# EAGLE design SparkFun_ProtoSnap-LilyTwinkle (EAGLE 6.3)
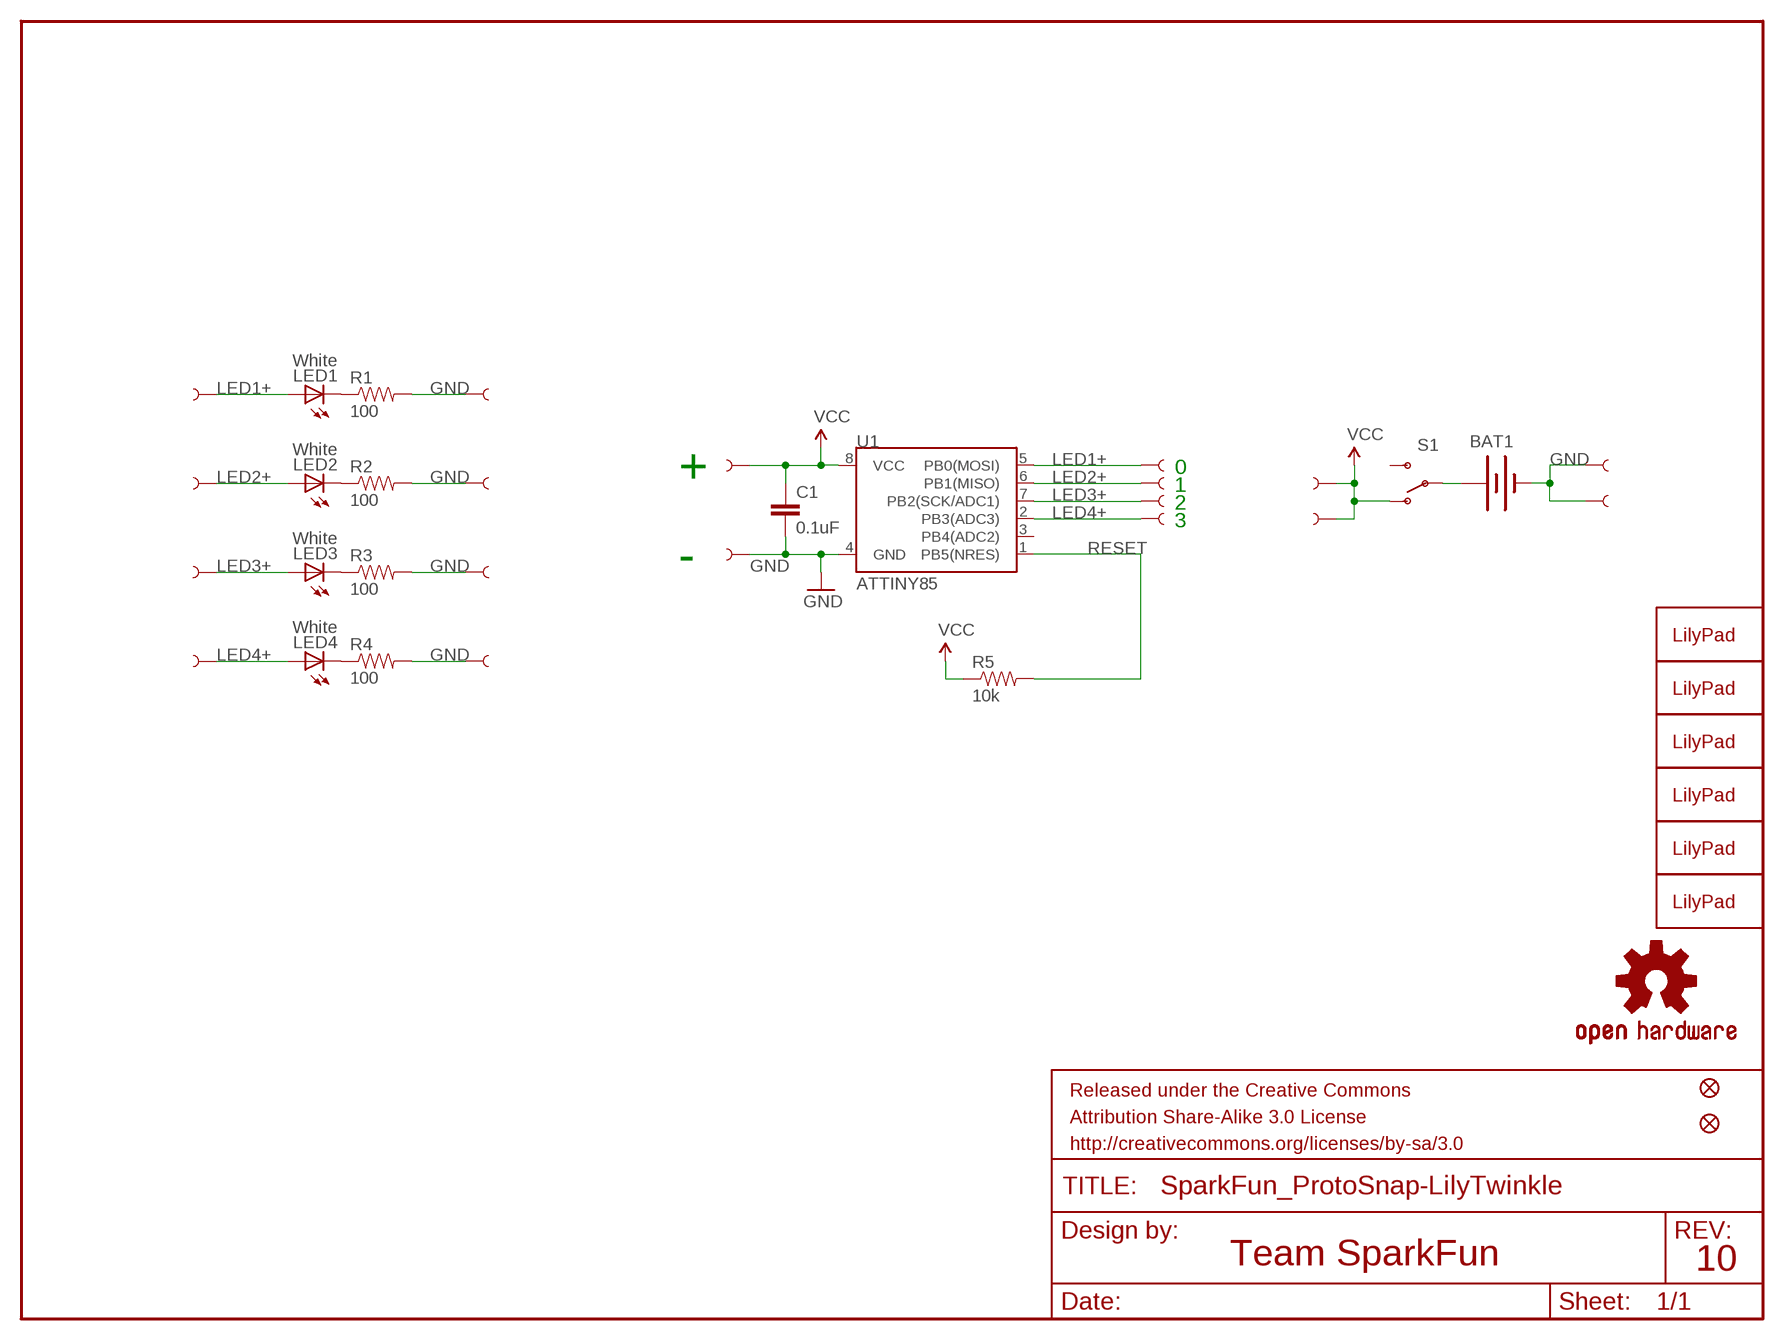
[diagram p0: schematic, sheet 1]

## Parts
1_U$2  SEWTAP6  [PETAL-SMALL-2SIDE]
1_U$3  SEWTAP6  [PETAL-SMALL-2SIDE]
1_U$4  SEWTAP6  [PETAL-SMALL-2SIDE]
1_U$5  SEWTAP6  [PETAL-SMALL-2SIDE]
1_U$6  SEWTAP6  [PETAL-SMALL-2SIDE]
1_U$7  SEWTAP6  [PETAL-SMALL-2SIDE]
3_LED+  SEWTAP6  SEWTAP4  [PETAL-SMALL]
3_LED-  SEWTAP6  SEWTAP2SIDE  [PETAL-SMALL]
4_LED+  SEWTAP6  SEWTAP4  [PETAL-SMALL]
4_LED-  SEWTAP6  SEWTAP2SIDE  [PETAL-SMALL]
5_LED+  SEWTAP6  SEWTAP4  [PETAL-SMALL]
5_LED-  SEWTAP6  SEWTAP2SIDE  [PETAL-SMALL]
6_LED+  SEWTAP6  SEWTAP4  [PETAL-SMALL]
6_LED-  SEWTAP6  SEWTAP2SIDE  [PETAL-SMALL]
B1+  SEWTAP6  [PETAL-SMALL-2SIDE]
B1-  SEWTAP6  [PETAL-SMALL-2SIDE]
B2+  SEWTAP6  [PETAL-SMALL-2SIDE]
B2-  SEWTAP6  [PETAL-SMALL-2SIDE]
BAT1  BATTERY20MM_4LEGS  [BATTCON_20MM_4LEGS]
BATT_LOGO  LOGO-LPLP  [LOGO-LILYPAD]
BATT_OHS  OSHW-LOGOS  [OSHW-LOGO-S]
C1  0.1uF  .1UF-CER  [0402-CAP]
FRAME1  FRAME-LETTER  [CREATIVE_COMMONS]
JP1  FIDUCIALUFIDUCIAL  [MICRO-FIDUCIAL]
JP2  FIDUCIALUFIDUCIAL  [MICRO-FIDUCIAL]
LED1  White  LED-WHITE  [LED-1206]
LED1_LOGO  LOGO-LPL  [LOGO-L]
LED2  White  LED-WHITE  [LED-1206]
LED2_LOGO  LOGO-LPL  [LOGO-L]
LED3  White  LED-WHITE  [LED-1206]
LED3_LOGO  LOGO-LPL  [LOGO-L]
LED4  White  LED-WHITE  [LED-1206]
LED4_LOGO  LOGO-LPL  [LOGO-L]
R1  100  RESISTOR0603-RES  [0603-RES]
R2  100  RESISTOR0603-RES  [0603-RES]
R3  100  RESISTOR0603-RES  [0603-RES]
R4  100  RESISTOR0603-RES  [0603-RES]
R5  10k  10K-1%RES-00824  [0402-RES]
S1  SWITCH-SPDTSMD  [AYZ0202]
TINY_LOGO  LOGO-LPL  [LOGO-L]
U1  ATTINY85  ATTINY45TINY85-20-SMT  [SO08-EIAJ]

## Nets
2_N$3: BAT1.1(+) S1.2(P)
3_N$1: LED3.C R3.1
4_N$1: LED4.C R4.1
5_N$1: LED2.C R2.1
6_N$1: LED1.C R1.1
GND: 1_U$2.1 3_LED-.1 4_LED-.1 5_LED-.1 6_LED-.1 B1-.1 B2-.1 BAT1.2(-) C1.2 R1.2 R2.2 R3.2 R4.2 U1.4(GND)
LED1+: 1_U$7.1 6_LED+.1 LED1.A U1.5(PB0(MOSI))
LED2+: 1_U$3.1 5_LED+.1 LED2.A U1.6(PB1(MISO))
LED3+: 1_U$4.1 3_LED+.1 LED3.A U1.7(PB2(SCK/ADC1))
LED4+: 1_U$6.1 4_LED+.1 LED4.A U1.2(PB3(ADC3))
RESET: R5.2 U1.1(PB5(NRES))
V+: 1_U$5.1 B1+.1 B2+.1 C1.1 R5.1 S1.1(O) U1.8(VCC) ; supply symbol labelled VCC
Unconnected: S1.3(S) U1.3(PB4(ADC2))

## Notes on the sheet
- 0
- +
- 1
- 2
- 3
- -
- Team SparkFun | 10

## Library data of the parts
1_U$2-1_U$7 = 1_LilyPad-Wearables:SEWTAP
3_LED+ 3_LED- = 3_LilyPad-Wearables:SEWTAP
4_LED+ 4_LED- = 4_LilyPad-Wearables:SEWTAP
5_LED+ 5_LED- = 5_LilyPad-Wearables:SEWTAP
6_LED+ 6_LED- = 6_LilyPad-Wearables:SEWTAP
B1+ B1- B2+ B2- = 2_LilyPad-Wearables:SEWTAP
BAT1 = SparkFun-Electromechanical:BATTERY: Battery Holders Various common sizes : AA, AAA, 20mm coin cell and 12mm coin cell. 20MM_4LEGS, BATT-10373; PROD_ID: BATT-10373; VALUE: 20mm coincell
BATT_LOGO LED1_LOGO LED2_LOGO LED3_LOGO LED4_LOGO TINY_LOGO = LilyPad-Wearables:LOGO-LP
BATT_OHS = 2_SparkFun-Aesthetics:OSHW-LOGO: Open Source Hardware Logo This logo indicates the piece of hardware it is found on incorporates a OSHW license and/or adheres to the definition of open source hardware found here: http://freedomdefined.org/OSHW
C1 = SparkFun-Capacitors:.1UF-CER: .1uF ceramic SMT CAP-00810- 25V +80%/-20% (0603) CAP-08390- 100V 10% (0603) CAP-08604- 25V 5% (0603); PROD_ID: CAP-00810
FRAME1 = SparkFun-Aesthetics:FRAME-LETTER: Schematic Frame Standard 8.5x11 US Letter frame
JP1 JP2 = SparkFun:FIDUCIAL: Fiducial Alignment Points Various fiducial points for machine vision alignment.
LED1-LED4 = SparkFun-LED:LED-WHITE: White SMD LEDs LilyPad 1206- DIO-09955; PROD_ID: DIO-09955; VALUE: WHITE
R1 = 6_SparkFun:RESISTOR: Resistor Basic schematic elements and footprints for 0603, 1206, and PTH resistors.; PROD_ID: RES-07863
R2 = 5_SparkFun:RESISTOR: Resistor Basic schematic elements and footprints for 0603, 1206, and PTH resistors.; PROD_ID: RES-07863
R3 = 3_SparkFun:RESISTOR: Resistor Basic schematic elements and footprints for 0603, 1206, and PTH resistors.; PROD_ID: RES-07863
R4 = 4_SparkFun:RESISTOR: Resistor Basic schematic elements and footprints for 0603, 1206, and PTH resistors.; PROD_ID: RES-07863
R5 = SparkFun-Resistors:10K-1%: 10k-ohm SMT 1/10W - 1% (0603) RES-00824; PROD_ID: RES-00824
S1 = SparkFun-Electromechanical:SWITCH-SPDT: SPDT Switch Simple slide switch, Spark Fun Electronics SKU : COM-00102 DPDT SMT slide switch, AYZ0202, SWCH-08179; PROD_ID: SWCH-08179
U1 = SparkFun-DigitalIC:ATTINY45: Atmel 8-pin 2/4/8kB flash uC; PROD_ID: IC-09092; VALUE: Tiny85-20-SMT

## Board
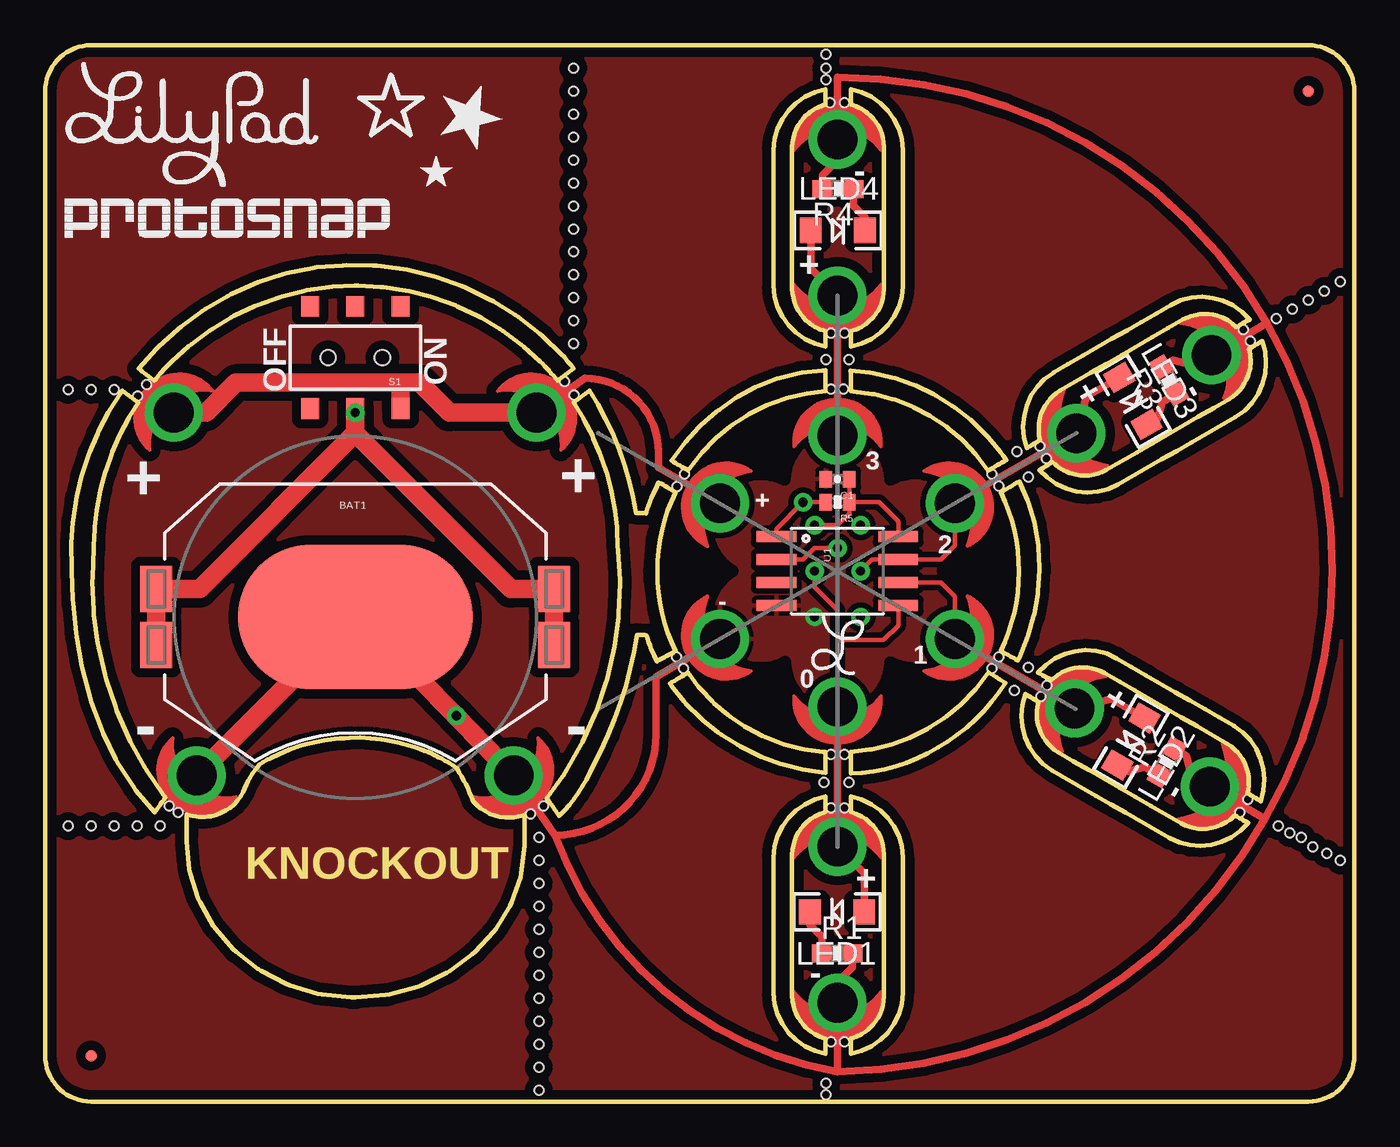
[diagram p1: board, top side]
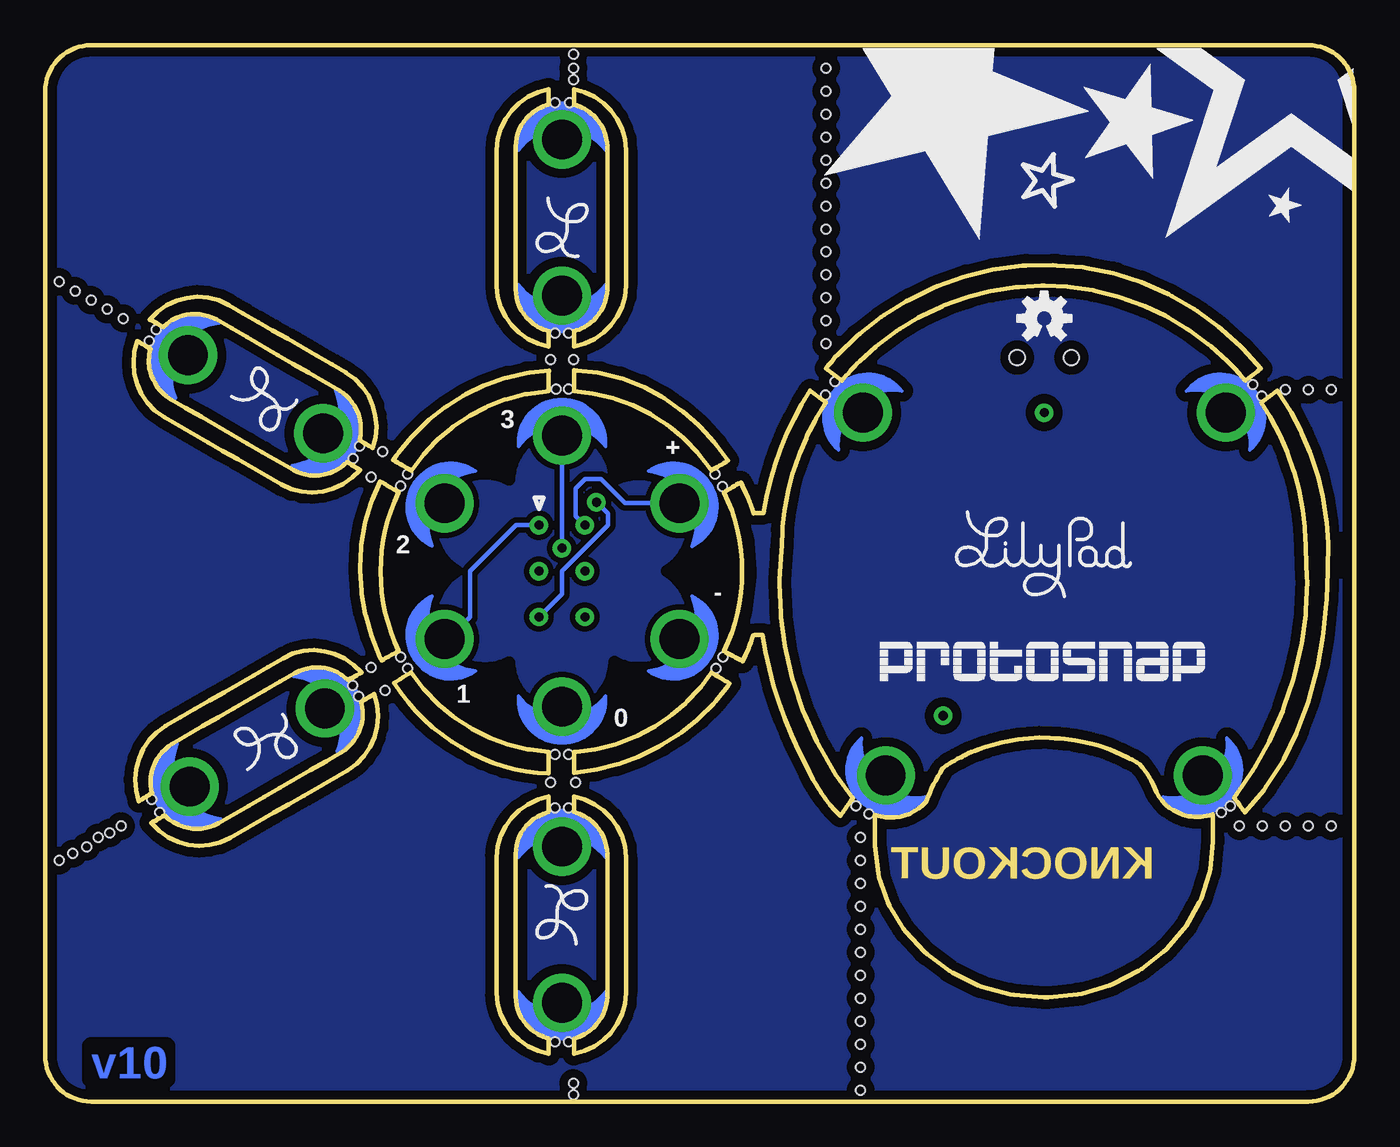
[diagram p2: board, bottom side, seen from below]

Size 72.39 x 58.42 mm. Coordinates in mm from the lower left corner, seen from the top.
Outline: 40.28,45.13 40.28,52.6 40.33,53.22 40.5,53.79 40.76,54.33 41.1,54.8 41.52,55.22 42.01,55.56 42.56,55.82 43.16,55.98 43.16,55.77 43.15,55.66 43.15,55.13 43,55.09 42.72,54.97 42.58,54.9 42.45,54.82 42.32,54.73 42.2,54.64 42.08,54.54 41.91,54.36 41.77,54.17 41.64,53.96 41.53,53.75 41.44,53.52 41.37,53.28 41.33,53.05 41.31,52.8 41.31,44.93 41.33,44.69 41.37,44.45 41.44,44.21 41.53,43.99 41.64,43.77 41.77,43.56 41.91,43.37 42.08,43.2 42.2,43.09 42.32,43 42.45,42.91 42.58,42.83 42.72,42.76 42.86,42.7 43,42.65 43.15,42.6 43.15,42.07 43.16,41.96 43.16,41.75 42.56,41.92 42.01,42.17 41.52,42.51 41.1,42.93 40.76,43.41 40.5,43.94 40.33,44.52 40.28,45.13
Outline: 40.28,45.13 40.28,45.1
Outline: 55.75,40.3 56.56,40.77 57.38,41.24 59,42.18 59.81,42.64 60.62,43.11 61.44,43.58 62.25,44.05 62.81,44.31 63.39,44.46 63.98,44.5 64.56,44.44 65.13,44.28 65.67,44.03 66.17,43.68 66.61,43.25 66.43,43.15 66.34,43.09 66.24,43.04 66.15,42.99 66.06,42.93 65.88,42.83 65.64,43.03 65.52,43.12 65.39,43.21 65.11,43.35 64.97,43.41 64.82,43.45 64.59,43.51 64.35,43.54 64.1,43.55 63.86,43.54 63.62,43.5 63.39,43.44 63.16,43.36 62.94,43.26 62.09,42.76 61.23,42.27 59.53,41.29 58.68,40.79 57.82,40.3 56.12,39.32 55.92,39.18 55.73,39.02 55.56,38.85 55.41,38.66 55.28,38.46 55.16,38.24 55.07,38.02 55,37.79 54.97,37.63 54.95,37.48 54.94,37.33 54.94,37.02 54.96,36.87 55.02,36.57 54.93,36.52 54.84,36.46 54.75,36.41 54.65,36.35 54.56,36.3 54.47,36.24 54.29,36.14 54.13,36.73 54.08,37.34 54.14,37.93 54.28,38.5 54.52,39.04 54.86,39.53 55.27,39.96 55.78,40.31
Outline: 65.73,20.77 66.23,20.42 66.64,19.99 66.97,19.51 67.21,18.97 67.36,18.4 67.42,17.81 67.37,17.21 67.22,16.61 67.13,16.67 67.04,16.72 66.95,16.78 66.85,16.83 66.76,16.89 66.67,16.94 66.58,17 66.49,17.05 66.52,17.2 66.56,17.5 66.56,17.8 66.55,17.95 66.53,18.1 66.5,18.24 66.43,18.48 66.34,18.7 66.22,18.92 66.09,19.12 65.94,19.31 65.77,19.48 65.58,19.64 65.38,19.78 63.68,20.76 62.82,21.25 61.97,21.75 60.27,22.73 59.41,23.22 58.56,23.71 58.34,23.82 58.11,23.9 57.88,23.96 57.64,24 57.4,24.01 57.15,24 56.91,23.97 56.68,23.91 56.53,23.87 56.39,23.81 56.26,23.75 56,23.59 55.76,23.41 55.65,23.31 55.55,23.36 55.37,23.46 55.28,23.52 55.18,23.57 55,23.67 54.9,23.73 55.34,24.15 55.84,24.49 56.38,24.74 56.95,24.9 57.53,24.96 58.12,24.91 58.7,24.77 59.25,24.51 60.06,24.04 60.88,23.57 62.5,22.63 63.31,22.17 64.12,21.7 64.94,21.23 65.75,20.76
Outline: 40.28,6.01 40.28,13.49 40.33,14.1 40.5,14.68 40.76,15.21 41.1,15.69 41.52,16.1 42.01,16.44 42.56,16.7 43.16,16.87 43.16,16.65 43.15,16.55 43.15,16.02 43,15.97 42.86,15.92 42.58,15.78 42.32,15.62 42.08,15.42 41.91,15.24 41.77,15.05 41.64,14.85 41.53,14.63 41.44,14.4 41.37,14.17 41.33,13.93 41.31,13.69 41.31,5.81 41.33,5.57 41.37,5.33 41.44,5.1 41.53,4.87 41.64,4.65 41.77,4.45 41.91,4.26 42.08,4.08 42.32,3.88 42.58,3.72 42.86,3.58 43,3.53 43.15,3.48 43.15,2.95 43.16,2.85 43.16,2.63 42.56,2.8 42.01,3.06 41.52,3.4 41.1,3.81 40.76,4.29 40.5,4.82 40.33,5.4 40.28,6.01
Outline: 40.28,6.01 40.28,5.99
Outline: 47.43,6.01 47.43,13.49 47.37,14.1 47.21,14.68 46.95,15.21 46.6,15.69 46.18,16.1 45.69,16.44 45.14,16.7 44.55,16.87 44.55,16.12 44.56,16.01 44.7,15.97 44.85,15.92 45.13,15.78 45.39,15.62 45.51,15.52 45.62,15.42 45.79,15.24 45.94,15.05 46.07,14.85 46.18,14.63 46.27,14.4 46.33,14.17 46.37,13.93 46.39,13.69 46.39,5.81 46.37,5.57 46.33,5.33 46.27,5.1 46.18,4.87 46.07,4.65 45.94,4.45 45.79,4.26 45.62,4.08 45.51,3.98 45.39,3.88 45.13,3.72 44.85,3.58 44.7,3.53 44.56,3.49 44.55,3.38 44.55,2.63 45.14,2.8 45.69,3.06 46.18,3.4 46.6,3.81 46.95,4.29 47.21,4.82 47.37,5.4 47.43,6.01
Outline: 47.43,6.01 47.43,5.99
Outline: 35.56,34.9 35.64,35.01 36.24,35.79 36.33,35.9 37.01,36.6 37.11,36.69 37.86,37.32 37.98,37.4 38.8,37.94 38.92,38.01 39.8,38.45 39.93,38.51 40.87,38.85 41,38.9 41.98,39.13 42.13,39.16 43.15,39.28 43.15,40.44 42.99,40.43 41.86,40.31 41.71,40.29 40.62,40.02 40.47,39.97 39.43,39.57 39.28,39.5 38.3,38.98 38.17,38.89 37.25,38.25 37.12,38.15 36.28,37.41 36.17,37.3 35.41,36.47 35.3,36.34 34.64,35.44 34.75,35.37 34.87,35.3 34.98,35.23 35.1,35.17 35.21,35.1 35.33,35.03 35.44,34.97 35.56,34.9
Outline: 29.22,40.54 29.16,40.62 29.1,40.69 29.03,40.77 28.97,40.85 28.9,40.93 28.84,41 28.77,41.08 28.71,41.16 28.57,41.31 27.51,42.33 27.35,42.46 26.19,43.37 26.01,43.49 24.76,44.26 24.58,44.36 23.25,45.01 23.05,45.09 21.66,45.59 21.46,45.65 20.03,46 19.82,46.03 18.36,46.22 18.15,46.23 16.68,46.25 16.46,46.24 15,46.13 14.79,46.1 13.36,45.82 13.16,45.77 11.79,45.32 11.6,45.24 10.28,44.65 10.1,44.55 8.86,43.82 8.68,43.71 7.52,42.85 7.36,42.72 6.29,41.74 6.14,41.6 5.17,40.52 5.28,40.44 5.38,40.36 5.6,40.2 5.71,40.11 5.81,40.03 6.03,39.87 6.13,39.99 6.24,40.12 6.34,40.24 6.67,40.6 7.03,40.96 7.95,41.79 8.09,41.9 9.09,42.64 9.24,42.73 10.31,43.37 10.46,43.45 11.59,43.98 11.75,44.05 12.92,44.47 13.09,44.52 14.3,44.82 14.47,44.86 15.7,45.04 15.88,45.06 17.12,45.12 17.3,45.12 18.54,45.05 18.71,45.04 19.94,44.85 20.12,44.81 21.32,44.5 21.49,44.45 22.66,44.03 22.82,43.96 23.95,43.43 24.1,43.34 25.17,42.71 25.32,42.61 26.32,41.87 26.45,41.76 27.37,40.92 27.5,40.8 27.63,40.67 27.87,40.41 27.99,40.27 28.11,40.14 28.22,40 28.34,39.86 28.45,39.95 28.56,40.03 28.67,40.12 28.78,40.2 28.89,40.29 29.11,40.45 29.22,40.54
Outline: 33.25,25.78 33.31,25.6 33.37,25.41 33.44,25.23 33.51,25.04 33.58,24.86 33.66,24.69 33.74,24.51 33.83,24.33 33.96,24.41 34.22,24.55 34.35,24.63 34.74,24.84 34.87,24.92 34.64,25.42 34.43,25.94 34.26,26.47 34.12,27.02 34,27.58 33.92,28.14 33.87,28.72 33.85,29.31 33.87,29.89 33.92,30.47 34,31.04 34.11,31.59 34.26,32.14 34.43,32.67 34.63,33.19 34.86,33.69 34.75,33.76 34.51,33.9 34.4,33.97 34.28,34.04 34.17,34.11 34.05,34.18 33.93,34.24 33.83,34.04 33.63,33.62 33.54,33.4 33.45,33.19 33.29,32.75 33.22,32.53 33.15,32.54 32.74,32.54 32.67,32.55 32.5,33.44 32.29,34.33 32.03,35.21 31.73,36.07 31.39,36.91 31,37.73 30.57,38.54 30.1,39.32 29.99,39.24 29.88,39.15 29.55,38.91 29.45,38.82 29.23,38.66 29.3,38.55 29.78,37.76 29.84,37.64 30.26,36.82 30.31,36.7 30.67,35.85 30.72,35.73 31.02,34.86 31.06,34.73 31.29,33.84 31.32,33.71 31.49,32.81 31.51,32.68 31.62,31.76 31.63,31.63 31.66,30.71 31.69,30.48 31.78,28.85 31.79,28.62 31.72,27 31.7,26.77 31.48,25.16 31.44,24.93 31.07,23.35 31,23.13 30.48,21.59 30.39,21.37 29.73,19.89 29.62,19.69 28.81,18.28 28.69,18.08 27.74,16.76 27.83,16.64 27.91,16.52 28,16.4 28.08,16.28 28.17,16.16 28.25,16.04 28.43,15.8 28.72,16.09 29,16.41 29.26,16.74 29.5,17.09 29.73,17.45 29.94,17.82 30.13,18.19 30.3,18.56 30.74,19.41 31.14,20.27 31.5,21.16 31.82,22.06 32.11,22.98 32.35,23.91 32.56,24.86 32.72,25.81 32.79,25.81 32.85,25.8 32.98,25.8 33.05,25.79 33.18,25.79 33.25,25.78
Outline: 34.55,23.12 34.64,22.99 35.33,22.12 35.44,22 36.23,21.21 36.35,21.11 37.22,20.41 37.36,20.31 38.3,19.71 38.44,19.64 39.45,19.14 39.6,19.07 40.65,18.68 40.81,18.64 41.89,18.36 42.05,18.33 43.16,18.18 43.16,18.32 43.15,18.46 43.15,19.33 43,19.34 41.98,19.48 41.84,19.51 40.86,19.76 40.73,19.81 39.8,20.16 39.67,20.22 38.79,20.68 38.67,20.75 37.86,21.3 37.75,21.39 37,22.02 36.9,22.12 36.23,22.83 36.14,22.94 35.56,23.72 35.43,23.65 35.3,23.57 35.18,23.5 35.05,23.42 34.92,23.35 34.8,23.27 34.67,23.2 34.55,23.12
Outline: 53.15,35.48 53.12,35.51 53.1,35.55 53.07,35.59 53.04,35.62 53.01,35.66 52.99,35.7 52.96,35.73 52.84,35.89 52.15,36.73 52.05,36.84 51.27,37.6 51.16,37.7 50.3,38.37 50.17,38.46 49.25,39.03 49.12,39.11 48.14,39.58 48,39.64 46.98,40 46.83,40.04 45.77,40.29 45.62,40.31 44.54,40.43 44.55,40.29 44.55,39.71 44.56,39.57 44.56,39.28 44.71,39.27 45.72,39.13 45.87,39.11 46.84,38.85 46.98,38.81 47.91,38.45 48.03,38.39 48.91,37.94 49.84,37.32 49.95,37.23 50.7,36.6 50.8,36.5 51.47,35.79 51.56,35.68 52.14,34.9 52.4,35.04 52.52,35.11 52.65,35.19 52.77,35.26 52.9,35.33 53.02,35.4 53.15,35.48
Outline: 44.55,18.14 45.17,18.18 45.8,18.26 46.41,18.37 47.03,18.53 47.63,18.73 48.22,18.97 48.79,19.25 49.36,19.57 49.92,19.91 50.46,20.29 50.97,20.69 51.45,21.13 51.91,21.6 52.34,22.09 52.74,22.61 53.1,23.15 52.74,23.36 52.63,23.44 52.15,23.72 52.07,23.61 51.47,22.83 51.38,22.73 50.7,22.02 50.6,21.93 49.85,21.3 49.73,21.22 48.91,20.68 48.79,20.61 47.91,20.17 47.78,20.11 46.84,19.76 46.71,19.72 45.72,19.48 45.58,19.46 44.56,19.33 44.56,18.88 44.55,18.73 44.55,18.14
Outline: 53.8,24.4 53.87,24.54 54.35,25.74 54.66,26.82 54.7,26.97 54.89,28.08 54.91,28.24 54.99,29.36 54.99,29.52 54.93,30.63 54.92,30.79 54.74,31.89 54.7,32.04 54.38,33.12 54.33,33.27 53.87,34.29 53.74,34.22 53.61,34.14 53.48,34.07 53.36,33.99 53.1,33.85 52.97,33.77 52.84,33.7 53.07,33.19 53.27,32.67 53.45,32.14 53.59,31.6 53.7,31.04 53.78,30.47 53.83,29.89 53.85,29.31 53.83,28.72 53.78,28.14 53.7,27.58 53.59,27.02 53.44,26.48 53.27,25.94 53.07,25.42 52.84,24.92 52.96,24.86 53.08,24.79 53.2,24.73 53.44,24.59 53.56,24.53 53.68,24.46 53.8,24.4
Outline: 6.65,16.82 6.51,17 5.61,18.32 5.49,18.52 4.71,19.92 4.61,20.12 3.97,21.59 3.89,21.81 3.38,23.33 3.32,23.55 2.96,25.11 2.92,25.33 2.7,26.92 2.68,27.15 2.61,28.75 2.62,28.98 2.7,30.58 2.7,30.71 2.74,31.65 2.75,31.78 2.86,32.71 2.88,32.84 3.05,33.76 3.08,33.89 3.33,34.8 3.37,34.92 3.67,35.81 3.72,35.93 4.09,36.79 4.15,36.92 4.58,37.75 4.65,37.86 5.14,38.66 5.03,38.74 4.92,38.83 4.7,38.99 4.59,39.08 4.37,39.24 4.26,39.33 4.17,39.19 3.57,38.24 3.49,38.1 2.97,37.1 2.9,36.95 2.46,35.92 2.4,35.77 2.05,34.7 2,34.54 1.74,33.45 1.71,33.29 1.54,32.17 1.52,32.01 1.45,30.88 1.45,30.72 1.48,29.58 1.48,29.35 1.53,27.76 1.55,27.53 1.71,25.92 1.74,25.69 2.03,24.1 2.08,23.87 2.49,22.31 2.56,22.09 3.12,20.58 3.21,20.37 3.91,18.93 4.02,18.73 4.89,17.39 5.02,17.21 6.06,15.98 6.13,16.09 6.21,16.19 6.28,16.3 6.35,16.4 6.43,16.51 6.5,16.61 6.58,16.72 6.65,16.82
Outline: 7.84,15.88 8.01,15.83 8.17,15.79 8.34,15.77 8.5,15.75 8.67,15.74 8.84,15.74 9.01,15.76 9.17,15.78 9.45,15.85 9.72,15.96 9.98,16.09 10.22,16.25 10.44,16.43 10.64,16.64 10.81,16.87 10.96,17.12 11.04,17.32 11.13,17.52 11.24,17.72 11.34,17.92 11.46,18.11 11.72,18.47 11.86,18.64 12.04,18.76 12.31,18.91 12.41,18.96 12.5,19 12.9,19.2 13.21,19.33 13.53,19.46 14.17,19.68 14.5,19.77 15.16,19.91 15.44,19.96 16,20.04 16.28,20.07 16.56,20.09 16.85,20.11 17.41,20.13 18.01,20.09 18.31,20.06 18.61,20.02 18.9,19.97 19.2,19.92 19.49,19.86 19.79,19.78 19.99,19.73 20.39,19.61 20.79,19.47 20.98,19.4 21.18,19.32 21.37,19.24 21.44,19.2 21.51,19.17 21.57,19.14 21.64,19.1 21.71,19.07 21.77,19.04 21.84,19 21.91,18.97 22.13,18.85 22.25,18.79 22.35,18.72 22.57,18.58 22.77,18.42 22.9,18.21 23.03,17.99 23.15,17.77 23.27,17.54 23.38,17.31 23.48,17.08 23.57,16.85 23.66,16.61 23.86,16.4 24.09,16.21 24.33,16.06 24.59,15.92 24.86,15.82 25.14,15.75 25.43,15.71 25.72,15.7 25.82,15.71 25.93,15.72 26.03,15.73 26.33,15.79 26.43,15.82 26.52,15.86 26.52,14.13 26.33,12.62 26.28,12.41 25.79,11.01 25.7,10.81 24.93,9.55 24.8,9.38 23.78,8.27 23.62,8.13 22.4,7.22 22.21,7.11 20.81,6.43 20.6,6.35 19.06,5.93 18.83,5.89 17.17,5.75 16.93,5.76 15.29,5.93 15.06,5.97 13.53,6.43 13.32,6.51 11.94,7.22 11.76,7.34 10.56,8.27 10.4,8.42 9.42,9.55 9.29,9.72 8.56,11.01 8.47,11.2 8.01,12.62 7.97,12.83 7.82,14.36 7.82,14.55 7.83,14.74 7.83,15.12 7.84,15.31 7.84,15.88
Outline: 47.43,45.1 47.37,44.52 47.21,43.94 46.95,43.41 46.6,42.93 46.18,42.51 45.69,42.17 45.14,41.92 44.55,41.75 44.55,42.49 44.56,42.6 44.7,42.65 44.85,42.7 44.99,42.76 45.13,42.83 45.26,42.91 45.39,43 45.51,43.09 45.79,43.37 45.94,43.56 46.07,43.77 46.18,43.99 46.27,44.21 46.33,44.45 46.37,44.69 46.39,44.93 46.39,52.8 46.37,53.05 46.33,53.28 46.27,53.52 46.18,53.75 46.07,53.96 45.94,54.17 45.79,54.36 45.62,54.54 45.51,54.64 45.39,54.73 45.26,54.82 45.13,54.9 44.99,54.97 44.85,55.03 44.7,55.09 44.56,55.13 44.55,55.24 44.55,55.98 45.14,55.82 45.69,55.56 46.18,55.22 46.6,54.8 46.95,54.33 47.21,53.79 47.37,53.22 47.43,52.6 47.43,45.1
Outline: 65.82,37.86 63.39,36.45 62.57,35.98 61.76,35.52 59.33,34.11 58.79,33.87 58.21,33.72 57.62,33.68 57.03,33.74 56.46,33.9 55.92,34.15 55.42,34.5 54.98,34.93 55.07,34.98 55.16,35.04 55.26,35.09 55.35,35.14 55.44,35.2 55.62,35.3 55.71,35.36 55.83,35.25 55.95,35.15 56.07,35.06 56.2,34.97 56.34,34.89 56.48,34.83 56.63,34.77 56.77,34.72 57.01,34.66 57.25,34.63 57.49,34.62 57.74,34.63 57.98,34.67 58.21,34.73 58.44,34.81 58.66,34.92 60.36,35.9 61.22,36.4 63.77,37.87 64.63,38.36 65.48,38.86 65.68,38.99 65.86,39.15 66.03,39.32 66.19,39.51 66.32,39.72 66.43,39.93 66.53,40.16 66.59,40.39 66.63,40.54 66.65,40.7 66.66,40.85 66.66,41.01 66.65,41.16 66.64,41.32 66.61,41.47 66.57,41.62 66.66,41.68 66.76,41.73 66.85,41.79 67.03,41.89 67.12,41.95 67.21,42 67.31,42.06 67.46,41.46 67.51,40.85 67.46,40.25 67.32,39.68 67.08,39.14 66.75,38.65 66.33,38.22 65.82,37.86
Outline: 55.68,18.32 58.11,16.91 58.93,16.44 59.74,15.98 62.17,14.57 62.71,14.32 63.3,14.18 63.89,14.14 64.48,14.2 65.05,14.36 65.6,14.62 66.1,14.97 66.54,15.41 66.44,15.46 66.26,15.56 66.17,15.62 66.07,15.67 65.89,15.77 65.8,15.83 65.56,15.61 65.3,15.43 65.02,15.29 64.88,15.23 64.73,15.18 64.49,15.12 64.25,15.09 64.01,15.08 63.76,15.09 63.52,15.13 63.29,15.19 63.06,15.27 62.84,15.38 61.14,16.36 60.28,16.85 59.43,17.35 57.73,18.33 56.87,18.82 56.02,19.31 55.82,19.45 55.64,19.61 55.47,19.78 55.31,19.97 55.18,20.18 55.07,20.39 54.98,20.62 54.91,20.85 54.87,21 54.85,21.16 54.84,21.32 54.84,21.48 54.85,21.63 54.89,21.95 54.93,22.1 54.84,22.15 54.75,22.21 54.66,22.26 54.57,22.32 54.48,22.37 54.38,22.42 54.29,22.48 54.2,22.53 54.04,21.93 53.99,21.32 54.03,20.73 54.18,20.15 54.42,19.6 54.75,19.11 55.17,18.68 55.68,18.32
Outline: 69.85,0 2.54,0 arc-90 0,2.54 0,55.88 arc-90 2.54,58.42 69.85,58.42 arc-90 72.39,55.88 72.39,2.54 arc-90 69.85,0
Copper layers (1*16): Top 0.035mm / dielectric 1.5mm / Bottom 0.035mm
Design rules "default": minimum track width 8mil, minimum drill 20mil, track to track 8mil, track to pad 8mil, pad to pad 8mil, via to via 8mil, smd to smd 8mil, copper to edge 8mil, drill to drill 8mil, minimum pad ring 12mil, minimum via ring 10mil, stop-mask expansion 4mil, vias tented up to drill 20mil, thermal gap 10mil
Holes 0.51 mm at 6.85,16.35 7.35,16 5.6,39.65 5.12,39.02 28.73,39.8 29.25,39.08 26.85,15.9 27.55,16.35 43.4,55.25 44.2,55.25 43.45,42.5 44.2,42.5 43.45,39.4 44.15,39.4 35.35,34.7 34.95,34 34.9,24.6 35.3,23.95 43.45,19.2 44.2,19.2 52.35,23.95 52.75,24.6 55.4,23 55.05,22.4 66.5,16.7 66.05,16 43.45,16.25 44.2,16.25 43.45,3.3 44.2,3.3 52.35,34.7 52.75,34.05 55,36.25 55.35,35.55 66.25,42.7 66.65,42.05 6.35,15.24 5.08,15.24 3.81,15.24 2.54,15.24 1.27,15.24 3.81,39.37 2.54,39.37 1.27,39.37 27.3,14.61 27.3,13.34 27.3,12.06 27.3,10.79 27.3,9.53 27.3,8.26 27.3,6.99 27.3,5.71 27.3,4.45 27.3,3.17 27.3,1.91 27.3,0.64 29.21,41.91 29.21,43.18 29.21,44.45 29.21,45.72 29.21,46.99 29.21,48.26 29.21,49.53 29.21,50.8 29.21,52.07 29.21,53.34 29.21,54.61 29.21,55.88 29.21,57.15 43.18,57.91 43.18,57.15 43.18,56.52 43.18,0.38 43.18,1.02 44.45,17.65 43.05,17.65 53.59,22.73 54.36,24 54.36,34.54 53.72,35.94 43.18,41.02 44.45,41.02 68.07,43.31 68.96,43.81 69.85,44.32 70.74,44.83 71.63,45.34 68.2,15.24 68.83,14.86 69.47,14.61 70.1,14.1 70.87,13.72 71.63,13.34
tRestrict: area 33.6,29.3 to 54,39.6; area 33.6,19.1 to 54,29.4
bRestrict: area 33.6,29.3 to 54,39.6; area 33.6,19.1 to 54,29.4

### Footprints (pad centres in the part's own frame; a part is rotated, then mirrored left to right if it is on the bottom)
PETAL-SMALL-2SIDE = drill 2.2: 1 0,0
PETAL-SMALL = drill 2.2: 1 0,0
BATTCON_20MM_4LEGS = smd 1.778 x 2.54: 1 -11,1.55; 3 11,1.55; P$1 -11,-1.55; P$2 11,-1.55 | smd 13 x 8: 2 0,0
0402-CAP = smd 0.7 x 0.9: 1 -0.65,0; 2 0.65,0
MICRO-FIDUCIAL = smd 0.635 x 0.635: 1 0,0
LED-1206 = smd 1.2 x 1.4: A -1.5,0; C 1.5,0
0603-RES = smd 1.1 x 1: 1 -0.85,0; 2 0.85,0
0402-RES = smd 0.7 x 0.9: 1 -0.65,0; 2 0.65,0
AYZ0202 = smd 1 x 1.15: 1 -2.5,2.825; 2 0,2.825; 3 2.5,2.825; 4 -2.5,-2.825; 5 0,-2.825; 6 2.5,-2.825 | hole 0.85: 1.5,0; -1.5,0
SO08-EIAJ = smd 0.61 x 2.21: 1 -1.905,-3.378; 2 -0.635,-3.378; 3 0.635,-3.378; 4 1.905,-3.378; 5 1.905,3.353; 6 0.635,3.353; 7 -0.635,3.353; 8 -1.905,3.353

### Placement (x,y rotation side)
1_U$2  37.32,25.59 300 top
1_U$3  50.31,25.59 60 top
1_U$4  50.31,33.09 120 top
1_U$5  37.32,33.09 240 top
1_U$6  43.81,36.83 180 top
1_U$7  43.81,21.84 0 top
3_LED+  57.02,36.96 300 top
3_LED-  64.5,41.27 120 top
4_LED+  43.81,44.58 0 top
4_LED-  43.81,53.21 180 top
5_LED+  56.93,21.73 240 top
5_LED-  64.4,17.42 60 top
6_LED+  43.81,14.1 180 top
6_LED-  43.81,5.46 0 top
B1+  7.11,38.1 223 top
B1-  8.38,18.03 317 top
B2+  27.18,38.1 137 top
B2-  25.91,18.03 43 top
BAT1  17.14,26.8 0 top
BATT_LOGO  17.14,30.61 0 bottom
BATT_OHS  17.14,43.31 0 bottom
C1  43.81,34.42 180 top
FRAME1  21.59,-8.89 0 top  (outside the outline)
JP1  2.54,2.54 0 top
JP2  69.85,55.88 0 top
LED1  43.8,10.49 180 top
LED1_LOGO  43.81,10.34 180 bottom
LED2  60.04,19.91 240 top
LED2_LOGO  60.18,19.85 120 bottom
LED3  60.16,38.74 300 top
LED3_LOGO  60.28,38.84 60 bottom
LED4  43.84,48.18 0 top
LED4_LOGO  43.81,48.34 0 bottom
R1  43.8,8.21 0 top
R2  62.02,18.77 60 top
R3  62.14,39.89 120 top
R4  43.84,50.47 180 top
R5  43.81,33.15 180 top
S1  17.14,41.15 180 top
TINY_LOGO  43.81,25.27 0 top
U1  43.81,29.34 270 top

### Tracks (layer width: path | path; a pad name or v marks a point on that pad's centre or on a via)
1_N$7  (via drill 0.51)
  other vias: 42.55,29.34
1_N$8  (via drill 0.51)
  other vias: 45.09,29.34
1_N$9  (via drill 0.51)
  Bottom 0.254: v45.09,31.88 46.35,31.88 48.9,29.34
2_N$3  (via drill 0.51)
  Top 1.016: S1.2 v17.14,38.1 17.14,36.96 | 17.14,36.96 8.54,28.35 BAT1.1 6.14,25.25 | 28.14,25.25 28.14,28.35 25.75,28.35 17.14,36.96
3_N$1
  Top 0.254: 61.69,38.4 61.71,38.49
  Top 0.406: LED3.C 61.53,37.8 61.69,38.4 61.76,38.69 R3.1
4_N$1
  Top 0.254: 44.9,49.34 44.83,49.4
  Top 0.406: LED4.C 45.34,48.9 44.9,49.34 44.69,49.55 R4.1
5_N$1
  Top 0.254: 60.51,18.42 60.6,18.44
  Top 0.406: LED2.C 59.91,18.26 60.51,18.42 60.8,18.5 R2.1
6_N$1
  Top 0.254: 42.74,9.34 42.8,9.27
  Top 0.406: LED1.C 42.3,9.78 42.74,9.34 42.95,9.12 R1.1
GND  (via drill 0.51)
  Top 0.406: R2.2 63.11,19.12 63.41,17.99 5_LED-.1 67.44,15.62 | R4.2 42.98,51.24 43.81,52.07 4_LED-.1 43.81,56.64 arc-60 67.56,43.05 | R3.2 62.38,41.01 63.51,40.7 3_LED-.1 67.56,43.05 | R1.2 44.65,7.43 43.81,6.6 6_LED-.1 43.81,1.65 | B2-.1 28.19,14.73 | 1_U$2.1 33.78,23.5 33.78,20.32 arc-90 28.19,14.73 | 28.19,14.73 arc60 43.81,1.65 | 43.81,1.65 arc60 67.44,15.62 | 67.44,15.62 arc60 67.56,43.05
  Top 1.016: 7.49,17.14 B1-.1 BAT1.2 17.4,26.8 B2-.1 v22.73,21.34
  other vias: 42.55,26.8
  pour Top (isolate 0.305): 43.18,38.1 36.83,34.29 35.56,33.02 35.56,25.4 41.91,20.32 46.99,20.32 52.07,25.4 52.07,34.29 44.45,38.1
LED1+
  Top 0.254: 42.55,29.34 42.55,28.45 43.81,27.18 43.81,25.53 | 1_U$7.1 43.81,25.53 | U1.5 47.17,26.34 46.35,25.53 43.81,25.53
  Top 0.406: 6_LED+.1 43.81,14.22 | LED1.A 45.3,12.62 6_LED+.1 | 1_U$7.1 6_LED+.1
LED2+
  Top 0.254: U1.6 49.53,28.7 50.31,27.92 1_U$3.1
  Top 0.406: 5_LED+.1 56.81,21.8 | LED2.A 58.95,22.28 5_LED+.1 | 1_U$3.1 5_LED+.1
  Bottom 0.254: 1_U$3.1 50.1,25.59 48.9,26.8 48.9,29.34
LED3+
  Top 0.254: 45.09,29.34 45.72,29.97 U1.7 49.53,29.97 50.31,30.75 1_U$4.1
  Top 0.406: 3_LED+.1 56.91,36.89 | LED3.A 57.56,38.98 3_LED+.1 | 1_U$4.1 3_LED+.1
LED4+  (via drill 0.51)
  Top 0.254: U1.2 41.91,29.97 42.55,30.61 v43.81,30.61
  Top 0.406: 4_LED+.1 43.81,44.45 | LED4.A 42.34,46.06 4_LED+.1 | 1_U$6.1 4_LED+.1
  Bottom 0.254: 1_U$6.1 v43.81,30.61
N$1
  pour Bottom (isolate 0.305): 44.45,38.1 43.18,38.1 36.83,34.29 35.56,33.02 35.56,25.4 36.83,24.13 41.91,20.32 46.99,20.32 52.07,25.4 52.07,34.29
N$2
  pour Bottom (isolate 0.508): 69.85,0 2.54,0 arc-90 0,2.54 0,55.88 arc-90 2.54,58.42 69.85,58.42 arc-90 72.39,55.88 72.39,2.54 arc-90
N$3
  pour Top (isolate 0.508): 69.85,0 2.54,0 arc-90 0,2.54 0,55.88 arc-90 2.54,58.42 69.85,58.42 arc-90 72.39,55.88 72.39,2.54 arc-90
RESET  (via drill 0.51)
  Top 0.254: R5.2 v41.91,33.15 40.44,31.67 U1.1
  Bottom 0.254: v41.91,33.15 41.27,32.51 41.27,31.88 43.81,29.34 43.81,28.07 v45.09,26.8
V+  (via drill 0.51)
  Top 0.254: U1.8 47.17,32.08 46.1,33.15 R5.1 | C1.1 R5.1 | R5.1 44.47,32.53 43.81,31.88 v42.55,31.88
  Top 0.406: 1_U$5.1 33.91,35.05 33.91,35.94 arc90 29.84,40.01 B2+.1
  Top 1.016: B2+.1 22.35,38.1 20.7,39.75 19.68,39.75 | 19.68,39.75 10.54,39.75 8.89,38.1 B1+.1 | S1.1 19.64,39.71 19.68,39.75
  Bottom 0.254: v42.55,31.88 43.05,32.38 43.05,33.91 42.55,34.42 41.66,34.42 40.33,33.09 1_U$5.1

### Text on the board
Bottom: v10
Dimension: KNOCKOUT
tPlace: - | + | OFF | ON | + | - | + | 3 | + | + | 2 | - | 1 | 0 | + | - | - | - | + | -
bPlace: 3 | + | 2 | - | 1 | 0
tValues: M. HORD